# EAGLE design OLED-Display (EAGLE 9.6.2)
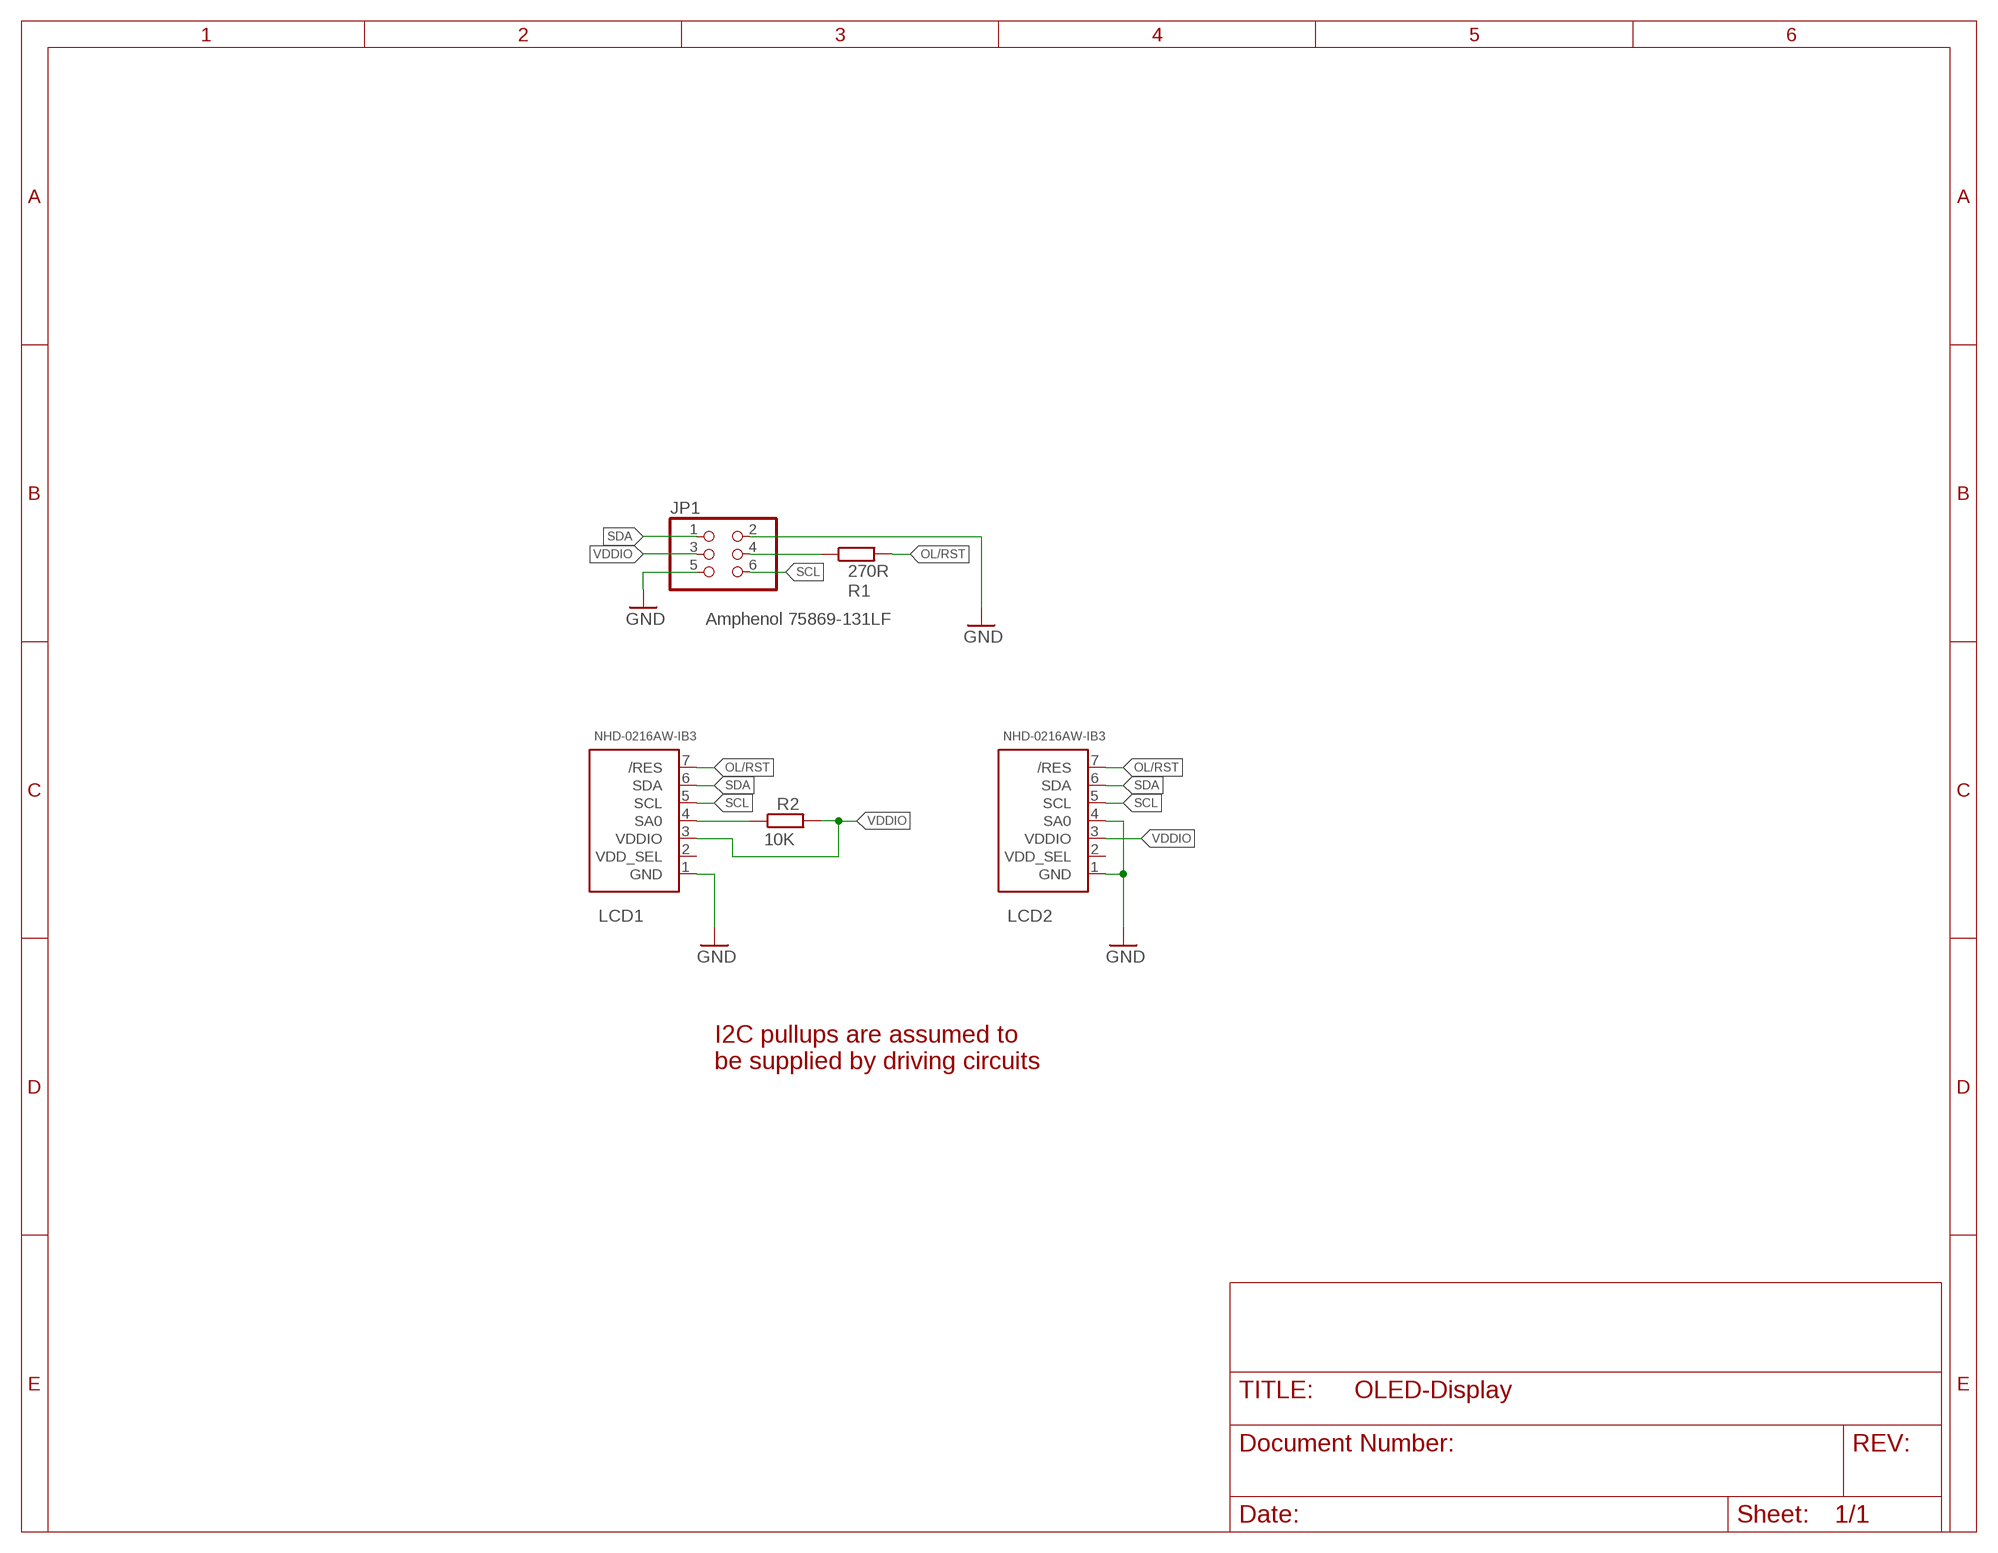
[diagram p0: schematic, sheet 1]

## Parts
JP1  Amphenol 75869-131LF  PINHD-2X32X03/SHROUDED  [PINHD-2X3-SHROUDED]
LCD1  NHD-0216AW-IB3  LCD-NEWHAVEN-16X2  [LCD-NEWHAVEN-16X2]
LCD2  NHD-0216AW-IB3  LCD-NEWHAVEN-16X2  [LCD-NEWHAVEN-16X2]
R1  270R  R-EU_R0805  [R0805]
R2  10K  R-EU_R0805  [R0805]

## Nets
ADDR1: LCD1.4(SA0) R2.1
GND: JP1.2 JP1.5 LCD1.1(GND) LCD2.1(GND) LCD2.4(SA0)
OL/RST: LCD1.7(/RES) LCD2.7(/RES) R1.2
RESET: JP1.4 R1.1
SCL: JP1.6 LCD1.5(SCL) LCD2.5(SCL)
SDA: JP1.1 LCD1.6(SDA) LCD2.6(SDA)
VDDIO: JP1.3 LCD1.3(VDDIO) LCD2.3(VDDIO) R2.2
Unconnected: LCD1.2(VDD_SEL) LCD2.2(VDD_SEL)

## Notes on the sheet
- I2C pullups are assumed to
  be supplied by driving circuits

## Library data of the parts
JP1 = AUmlib:PINHD-2X3: PIN HEADER
LCD1 LCD2 = AUmlib:LCD-NEWHAVEN-16X2: Newhaven I2C LCD 16x2
R1 R2 = AUmlib:R-EU_: RESISTOR, European symbol; SPICEPREFIX: R

## Board
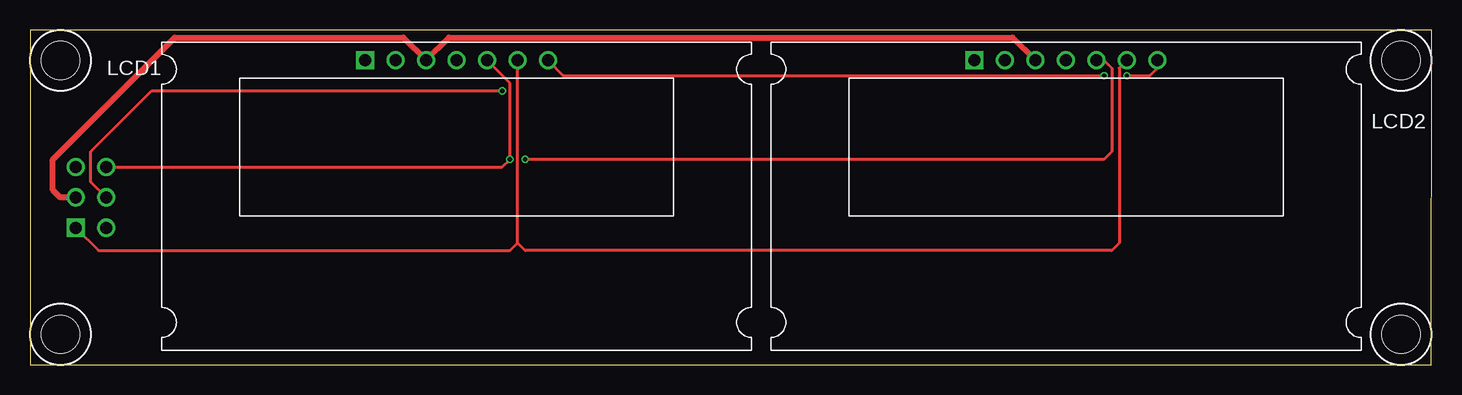
[diagram p1: board, top side]
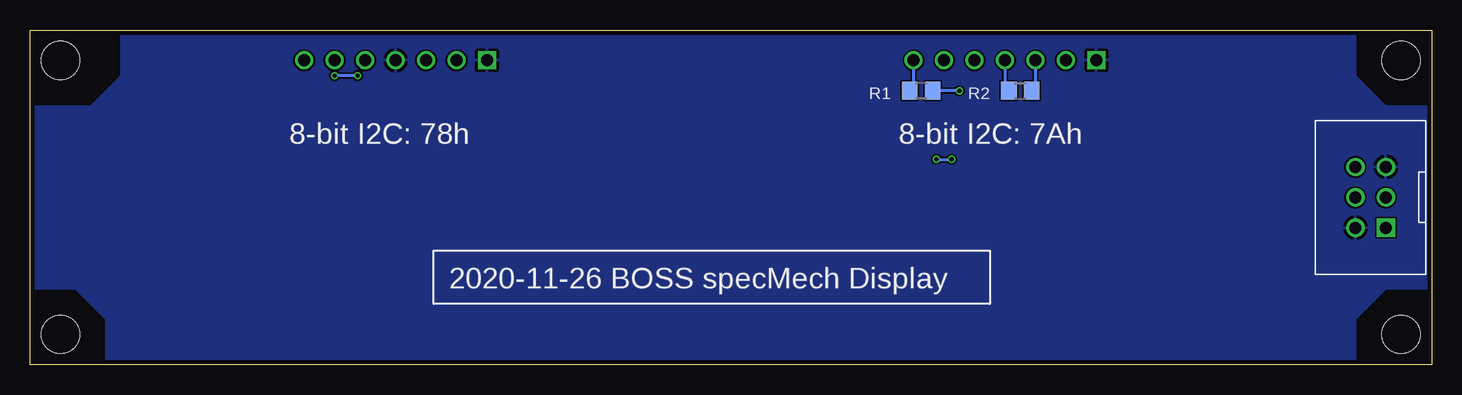
[diagram p2: board, bottom side, seen from below]

Size 116.84 x 27.94 mm. Coordinates in mm from the lower left corner, seen from the top.
Outline: 0,0 116.82,0 116.84,27.94 0,27.94 0,0
Copper layers (1*16): Top 0.035559375mm / dielectric 1.6mm / Bottom 0.035559375mm
Design rules "oshpark-2layer": minimum track width 6mil, minimum drill 10mil, track to track 6mil, track to pad 6mil, pad to pad 6mil, via to via 6mil, smd to smd 6mil, copper to edge 15mil, drill to drill 6mil, minimum pad ring 5mil, minimum via ring 5mil, stop-mask expansion 2.5mil, vias tented up to drill 0mil, thermal gap 10mil
Holes 3.17 mm at 2.54,2.54 2.54,25.4 114.3,25.4 114.3,2.54

### Footprints (pad centres in the part's own frame; a part is rotated, then mirrored left to right if it is on the bottom)
PINHD-2X3-SHROUDED = drill 1.016 square: 1 -2.54,-1.27 | drill 1.016: 2 -2.54,1.27; 3 0,-1.27; 4 0,1.27; 5 2.54,-1.27; 6 2.54,1.27
LCD-NEWHAVEN-16X2 = drill 1 square: 1 -7.62,0 | drill 1: 2 -5.08,0; 3 -2.54,0; 4 0,0; 5 2.54,0; 6 5.08,0; 7 7.62,0
R0805 = smd 1.3 x 1.5: 1 -0.95,0; 2 0.95,0

### Placement (x,y rotation side)
JP1  5.08,13.97 90 bottom
LCD1  35.56,25.4 0 top
LCD2  86.36,25.4 0 top
R1  42.55,22.86 180 bottom
R2  34.29,22.86 0 bottom

### Tracks (layer width: path | path; a pad name or v marks a point on that pad's centre or on a via)
ADDR1
  Bottom 0.152: 35.56,23.18 R2.1
  Bottom 0.254: LCD1.4 35.56,23.18
GND
  pour Bottom: 6.35,0 110.49,0 110.49,3.81 113.03,6.35 116.84,6.35 116.84,21.59 111.76,21.59 109.22,24.13 109.22,27.94 6.35,27.94 6.35,24.13 3.81,21.59 0,21.59 0,6.35 3.81,6.35 6.35,3.81
OL/RST  (via drill 0.35)
  Top 0.254: LCD1.7 44.45,24.13 v89.53,24.13 | v91.44,24.13 93.34,24.13 93.98,24.77 LCD2.7
  Bottom 0.152: 43.18,23.18 R1.2
  Bottom 0.254: LCD1.7 43.18,23.18 | v89.53,24.13 v91.44,24.13
RESET  (via drill 0.35)
  Top 0.254: JP1.4 5.08,15.24 5.08,17.78 10.16,22.86 v39.37,22.86
  Bottom 0.254: v39.37,22.86 R1.1
SCL  (via drill 0.35)
  Top 0.254: LCD2.5 89.53,25.4 90.17,24.77 90.17,17.78 89.53,17.14 v41.27,17.14 | LCD1.5 40.01,23.5 v40.01,17.14 39.37,16.51 JP1.6
  Bottom 0.254: v41.27,17.14 v40.01,17.14
SDA
  Top 0.254: JP1.1 5.71,9.53 40.01,9.53 40.64,10.16 | 40.64,10.16 LCD1.6 | LCD2.6 90.81,24.77 90.81,10.16 90.17,9.53 41.27,9.53 40.64,10.16
VDDIO
  Top 0.508: JP1.3 2.54,13.97 1.91,14.61 1.91,17.14 12.06,27.3 31.11,27.3 LCD1.3 34.92,27.3 81.92,27.3 LCD2.3
  Bottom 0.152: 33.02,23.18 R2.2
  Bottom 0.254: LCD1.3 33.02,23.18

### Text on the board
bPlace: 8-bit I2C: 7Ah | 8-bit I2C: 78h | 2020-11-26 BOSS specMech Display